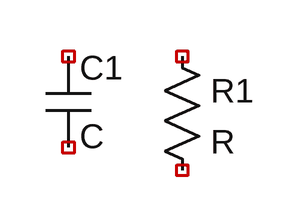
[diagram p0: schematic Draft1.asc]
Draft1.asc, the LTspice schematic file:
Version 4
SHEET 1 880 680
SYMBOL res 96 272 R0
SYMATTR InstName R1
SYMBOL cap 16 288 R0
SYMATTR InstName C1

The netlist it stands for:
* Draft1.asc
R1 NC_01 NC_02 R
C1 NC_03 NC_04 C
.backanno
.end